# Altium project TempGuard.PrjPcb (part 2 of 2)

## Sheet Display.SchDoc: 7-SEGMENT DISPLAY & DRIVER
size A4; SheetNumber: 2; SheetTotal: 5; DOC_NO_SCH_DWG: #032024040601
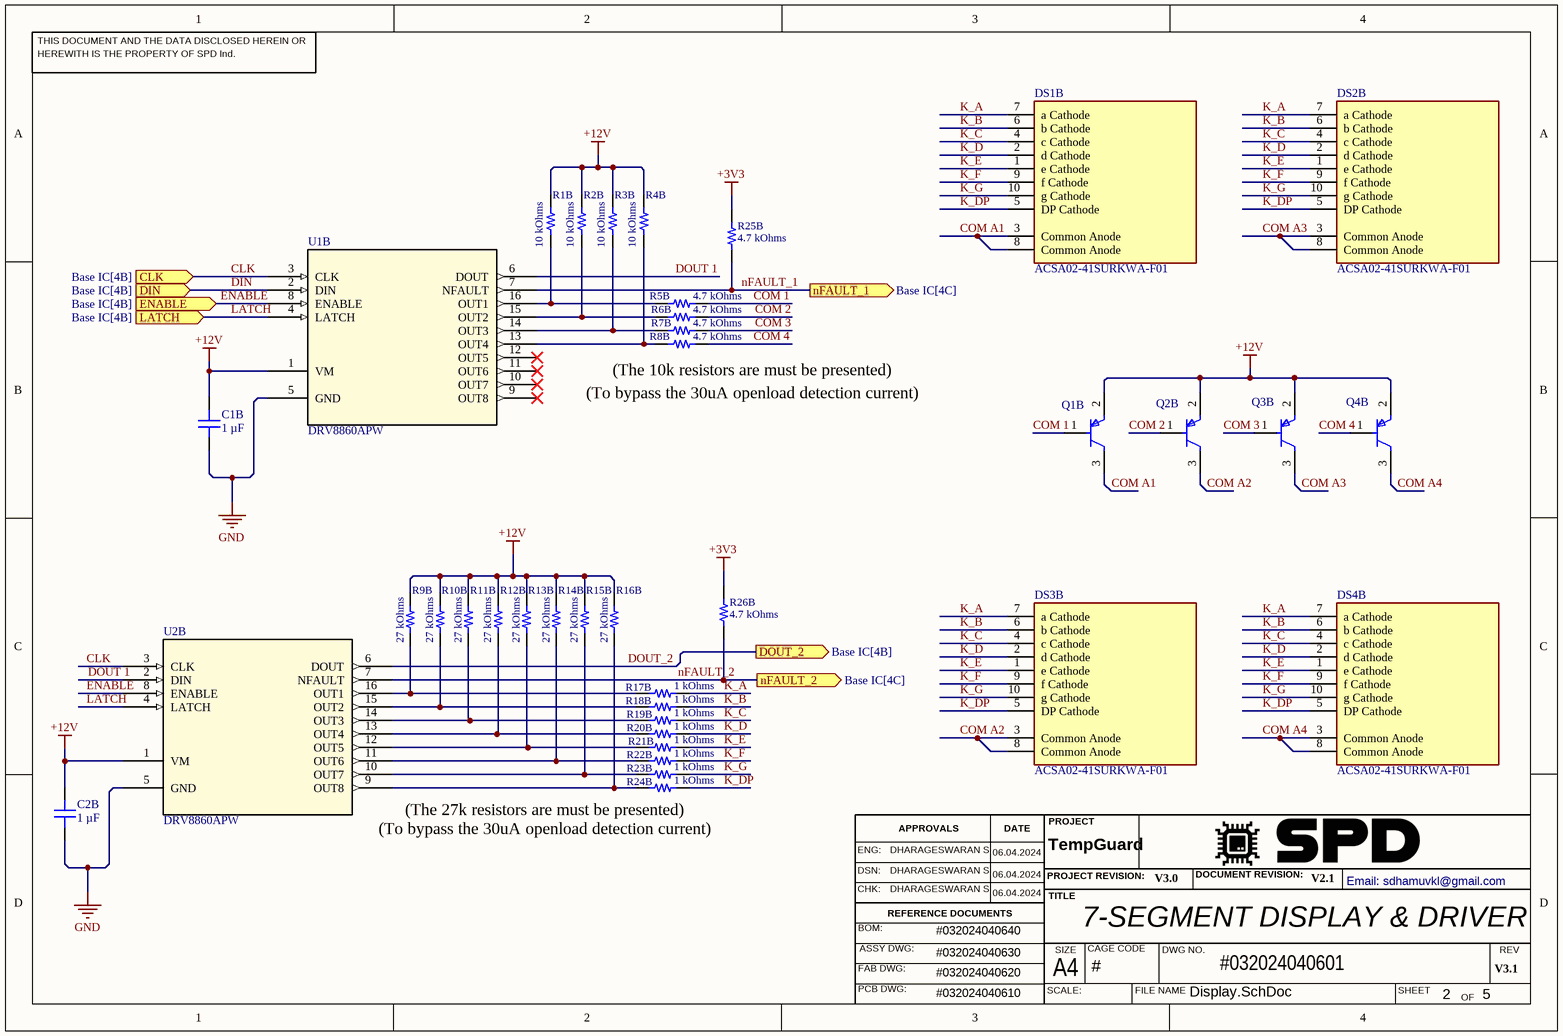
[diagram p3: Display.SchDoc]

### Parts
C1B  1 µF  [CAP 0402_1005]
C2B  1 µF  [CAP 0402_1005]
DS1B  ACSA02-41SURKWA-F01  [FP-ACSA02-41SURKWA-F01-MFG]
DS2B  ACSA02-41SURKWA-F01  [FP-ACSA02-41SURKWA-F01-MFG]
DS3B  ACSA02-41SURKWA-F01  [FP-ACSA02-41SURKWA-F01-MFG]
DS4B  ACSA02-41SURKWA-F01  [FP-ACSA02-41SURKWA-F01-MFG]
Q1B  MMBT3906FZ-7B  [FP-X2-DFN0606-3-MFG]  (value not drawn)
Q2B  MMBT3906FZ-7B  [FP-X2-DFN0606-3-MFG]  (value not drawn)
Q3B  MMBT3906FZ-7B  [FP-X2-DFN0606-3-MFG]  (value not drawn)
Q4B  MMBT3906FZ-7B  [FP-X2-DFN0606-3-MFG]  (value not drawn)
R1B  10 kOhms  [RES 0402_1005]
R2B  10 kOhms  [RES 0402_1005]
R3B  10 kOhms  [RES 0402_1005]
R4B  10 kOhms  [RES 0402_1005]
R5B  4.7 kOhms  [RES 0402_1005]
R6B  4.7 kOhms  [RES 0402_1005]
R7B  4.7 kOhms  [RES 0402_1005]
R8B  4.7 kOhms  [RES 0402_1005]
R9B  27 kOhms  [RES 0402_1005]
R10B  27 kOhms  [RES 0402_1005]
R11B  27 kOhms  [RES 0402_1005]
R12B  27 kOhms  [RES 0402_1005]
R13B  27 kOhms  [RES 0402_1005]
R14B  27 kOhms  [RES 0402_1005]
R15B  27 kOhms  [RES 0402_1005]
R16B  27 kOhms  [RES 0402_1005]
R17B  1 kOhms  [RES 0402_1005]
R18B  1 kOhms  [RES 0402_1005]
R19B  1 kOhms  [RES 0402_1005]
R20B  1 kOhms  [RES 0402_1005]
R21B  1 kOhms  [RES 0402_1005]
R22B  1 kOhms  [RES 0402_1005]
R23B  1 kOhms  [RES 0402_1005]
R24B  1 kOhms  [RES 0402_1005]
R25B  4.7 kOhms  [RES 0402_1005]
R26B  4.7 kOhms  [RES 0402_1005]
U1B  DRV8860APW  [PW_16]
U2B  DRV8860APW  [PW_16]

### Ports
CLK (in, see Base IC[4B]), DIN (in, see Base IC[4B]), DOUT_2 (out, see Base IC[4B]), ENABLE (in, see Base IC[4B]), LATCH (in, see Base IC[4B]), nFAULT_1 (out, see Base IC[4C]), nFAULT_2 (out, see Base IC[4C])

### Nets
+3V3: R25B.2 R26B.2
+12V: C1B.1 C2B.1 Q1B.2(E) Q2B.2(E) Q3B.2(E) Q4B.2(E) R1B.2 R2B.2 R3B.2 R4B.2 R9B.2 R10B.2 R11B.2 R12B.2 R13B.2 R14B.2 R15B.2 R16B.2 U1B.1(VM) U2B.1(VM)
GND: C1B.2 C2B.2 U1B.5(GND) U2B.5(GND)
CLK: U1B.3(CLK) U2B.3(CLK) ; port CLK
COM 1: Q1B.1(B) R5B.2
COM 2: Q2B.1(B) R6B.2
COM 3: Q3B.1(B) R7B.2
COM 4: Q4B.1(B) R8B.2
COM A1: DS1B.3(Common_Anode) DS1B.8(Common_Anode) Q1B.3(C)
COM A2: DS3B.3(Common_Anode) DS3B.8(Common_Anode) Q2B.3(C)
COM A3: DS2B.3(Common_Anode) DS2B.8(Common_Anode) Q3B.3(C)
COM A4: DS4B.3(Common_Anode) DS4B.8(Common_Anode) Q4B.3(C)
DIN: U1B.2(DIN) ; port DIN
DOUT 1: U1B.6(DOUT) U2B.2(DIN)
DOUT_2: U2B.6(DOUT) ; port DOUT_2
ENABLE: U1B.8(ENABLE) U2B.8(ENABLE) ; port ENABLE  [project net DRV_ENABLE]
K_A: DS1B.7(a_Cathode) DS2B.7(a_Cathode) DS3B.7(a_Cathode) DS4B.7(a_Cathode) R17B.2
K_B: DS1B.6(b_Cathode) DS2B.6(b_Cathode) DS3B.6(b_Cathode) DS4B.6(b_Cathode) R18B.2
K_C: DS1B.4(c_Cathode) DS2B.4(c_Cathode) DS3B.4(c_Cathode) DS4B.4(c_Cathode) R19B.2
K_D: DS1B.2(d_Cathode) DS2B.2(d_Cathode) DS3B.2(d_Cathode) DS4B.2(d_Cathode) R20B.2
K_DP: DS1B.5(DP_Cathode) DS2B.5(DP_Cathode) DS3B.5(DP_Cathode) DS4B.5(DP_Cathode) R24B.2
K_E: DS1B.1(e_Cathode) DS2B.1(e_Cathode) DS3B.1(e_Cathode) DS4B.1(e_Cathode) R21B.2
K_F: DS1B.9(f_Cathode) DS2B.9(f_Cathode) DS3B.9(f_Cathode) DS4B.9(f_Cathode) R22B.2
K_G: DS1B.10(g_Cathode) DS2B.10(g_Cathode) DS3B.10(g_Cathode) DS4B.10(g_Cathode) R23B.2
LATCH: U1B.4(LATCH) U2B.4(LATCH) ; port LATCH  [project net DRV_LATCH]
nFAULT_1: R25B.1 U1B.7(NFAULT) ; port nFAULT_1  [project net DRV_nFAULT1]
nFAULT_2: R26B.1 U2B.7(NFAULT) ; port nFAULT_2  [project net DRV_nFAULT2]
NetR1B_1: R1B.1 R5B.1 U1B.16(OUT1)
NetR2B_1: R2B.1 R6B.1 U1B.15(OUT2)
NetR3B_1: R3B.1 R7B.1 U1B.14(OUT3)
NetR4B_1: R4B.1 R8B.1 U1B.13(OUT4)
NetR9B_1: R9B.1 R17B.1 U2B.16(OUT1)
NetR10B_1: R10B.1 R18B.1 U2B.15(OUT2)
NetR11B_1: R11B.1 R19B.1 U2B.14(OUT3)
NetR12B_1: R12B.1 R20B.1 U2B.13(OUT4)
NetR13B_1: R13B.1 R21B.1 U2B.12(OUT5)
NetR14B_1: R14B.1 R22B.1 U2B.11(OUT6)
NetR15B_1: R15B.1 R23B.1 U2B.10(OUT7)
NetR16B_1: R16B.1 R24B.1 U2B.9(OUT8)

Not connected (* = marked no-connect by the designer): U1B 9(OUT8)* 10(OUT7)* 11(OUT6)* 12(OUT5)*

### Notes on the sheet
- (near R8B) (The 10k resistors are must be presented)
- (To bypass the 30uA openload detection current)
- (near R24B) (The 27k resistors are must be presented)
- THIS DOCUMENT AND THE DATA DISCLOSED HEREIN OR
- HEREWITH IS THE PROPERTY OF SPD Ind.
- ENG:
- DHARAGESWARAN S
- APPROVALS
- DATE
- PROJECT
- DSN:
- CHK:
- REFERENCE DOCUMENTS
- PROJECT REVISION:
- TITLE
- DOCUMENT REVISION:
- Email: sdhamuvkl@gmail.com <https://github.com/DhamuVkl>
- BOM:
- FAB DWG:
- PCB DWG:
- ASSY DWG:
- SCALE:
- A4
- SIZE
- CAGE CODE
- FILE NAME
- DWG NO.
- SHEET
- REV
- OF

### Library data of the parts
C1B C2B = GRM155C81C105KE15J: CAP CER MLCC; Manufacturer: Murata Electronics; id: 7124; Temperature Coefficient: X6S; Tolerance: ±10%; Voltage - Rated: 16V; Part Number: GRM155C81C105KE15J; Value: 1 µF; Supplier Part Number 1: 490-GRM155C81C105KE15JCT-ND; ComponentLink2Description: DigiKey Link; PartId: 54559; Supplier 1: DigiKey; Series: GRM; LastUpdated: 2023-06-29T19:02:33.680; Part Status: Active; Capacitance: 1 µF; Device Package: 0402 (1005 Metric); Thickness (Max): 0.022" (0.55mm); Minimum Order: 1; Packaging: CutTape; Applications: General Purpose; Package / Case: 0402 (1005 Metric); Price: 0.01; ComponentLink2URL: https://www.digikey.com/en/products/detail/murata-electronics/GRM155C81C105KE15J/10697200; Lifecycle Status: Active; Operating Temperature: -55°C ~ 105°C; Size / Dimension: 0.039" L x 0.020" W (1.00mm x 0.50mm); Mounting Type: Surface Mount, MLCC
DS1B DS2B DS3B DS4B = CMP-44525-000003-1: DISPLAY 7-SEG 0.2" SGL RED 10SMD; Element Configuration: Common Anode; Forward Current: 30mA; Wavelength: 630nm; Operating Supply Voltage: 1.95V; Number of Characters: 1; Max Power Dissipation: 75mW; Luminous Intensity: 30mcd; Test Current: 20mA; Package Quantity: 650; Width: 0.272inch; Max Operating Temperature: 85°C; Case/Package: SMD/SMT; Illumination Color: Red; Min Operating Temperature: -40°C; Packaging: Tape and Reel; Power Consumption: 75mW; Forward Voltage: 1.95V; Color: Red; Height: 0.315inch
Q1B Q2B Q3B Q4B = CMP-12798-000043-1: TRANS PNP 40V 0.2A X2-DFN060; Continuous Collector Current: -200mA; Gain Bandwidth Product: 250MHz; Collector Base Voltage (VCBO): -40V; Emitter Base Voltage (VEBO): -6V; Element Configuration: Single; hFE Min: 100; Max Power Dissipation: 435mW; Collector Emitter Voltage (VCEO): 400mV; Collector Emitter Saturation Voltage: -400mV; Transition Frequency: 280MHz; Max Collector Current: 200mA; Mount: Surface Mount; Polarity: PNP; Min Operating Temperature: -55°C; Max Operating Temperature: 150°C; Package Quantity: 10000; Max Breakdown Voltage: 40V; Collector Emitter Breakdown Voltage: 40V; Packaging: Tape and Reel; Number of Pins: 3
R1B R2B R3B R4B = AA0402FR-0710KL: RES SMD 10K OHM 1% 1/16W 0402; Manufacturer: Yageo; id: 10610; Temperature Coefficient: ±150ppm/°C; Power (Watts): 0.063W, 1/16W; Part Number: AA0402FR-0710KL; Height - Seated (Max): 0.015" (0.37mm); Supplier Part Number 1: 13-AA0402FR-0710KLCT-ND; Supplier Device Package: 0402; ComponentLink1Description: Datasheet; ComponentLink2URL: https://www.digikey.com/en/products/detail/yageo/AA0402FR-0710KL/5887729; Features: Anti-Sulfur, Automotive AEC-Q200, Moisture Resistant; ComponentLink1URL: https://www.yageo.com/upload/media/product/productsearch/datasheet/rchip/PYu-AA_51_RoHS_L_3.pdf; Composition: Thick Film; Tolerance: ±1%; Supplier 1: DigiKey; Series: AA; Part Status: Active; ComponentLink2Description: DigiKey Link; Device Package: 0402 (1005 Metric); Packaging: TapeAndReel; Ratings: AEC-Q200; Minimum Order: 1; Package / Case: 0402 (1005 Metric); PartId: 59190; Lifecycle Status: Active; LastUpdated: 2023-01-02T20:20:10.303; Operating Temperature: -55°C ~ 155°C; Number Of Terminations: 2; Value: 10 kOhms; Size / Dimension: 0.039" L x 0.020" W (1.00mm x 0.50mm); Price: 0.01; Resistance: 10 kOhms
R5B R6B R7B R8B R25B R26B = AC0402FR-074K7L: RES SMD 4.7K OHM 1% 1/16W 0402; Manufacturer: Yageo; id: 4996; Temperature Coefficient: ±100ppm/°C; Power (Watts): 0.063W, 1/16W; Part Number: AC0402FR-074K7L; Height - Seated (Max): 0.015" (0.37mm); Supplier Part Number 1: YAG3497CT-ND; Supplier Device Package: 0402; ComponentLink1Description: Datasheet; ComponentLink2URL: https://www.digikey.com/en/products/detail/yageo/AC0402FR-074K7L/5895396; Features: Automotive AEC-Q200, Moisture Resistant; ComponentLink1URL: https://www.yageo.com/upload/media/product/productsearch/datasheet/rchip/PYu-AC_51_RoHS_L_7.pdf; Composition: Thick Film; Tolerance: ±1%; Supplier 1: DigiKey; Series: AC; Part Status: Active; ComponentLink2Description: DigiKey Link; Device Package: 0402 (1005 Metric); Packaging: CutTape; Ratings: AEC-Q200; Minimum Order: 1; Package / Case: 0402 (1005 Metric); PartId: 12051; Lifecycle Status: Active; LastUpdated: 2023-01-02T20:21:09.847; Operating Temperature: -55°C ~ 155°C; Number Of Terminations: 2; Value: 4.7 kOhms; Size / Dimension: 0.039" L x 0.020" W (1.00mm x 0.50mm); Price: 0.01; Resistance: 4.7 kOhms
R9B R10B R11B R12B R13B R14B R15B R16B = AC0402FR-0727KL: RES SMD 27K OHM 1% 1/16W 0402; Manufacturer: Yageo; id: 5006; Temperature Coefficient: ±100ppm/°C; Power (Watts): 0.063W, 1/16W; Part Number: AC0402FR-0727KL; Height - Seated (Max): 0.015" (0.37mm); Supplier Part Number 1: YAG3466CT-ND; Supplier Device Package: 0402; ComponentLink1Description: Datasheet; ComponentLink2URL: https://www.digikey.com/en/products/detail/yageo/AC0402FR-0727KL/5895228; Features: Automotive AEC-Q200, Moisture Resistant; ComponentLink1URL: https://www.yageo.com/upload/media/product/productsearch/datasheet/rchip/PYu-AC_51_RoHS_L_7.pdf; Composition: Thick Film; Tolerance: ±1%; Supplier 1: DigiKey; Series: AC; Part Status: Active; ComponentLink2Description: DigiKey Link; Device Package: 0402 (1005 Metric); Packaging: CutTape; Ratings: AEC-Q200; Minimum Order: 1; Package / Case: 0402 (1005 Metric); PartId: 12068; Lifecycle Status: Active; LastUpdated: 2023-01-02T20:21:09.767; Operating Temperature: -55°C ~ 155°C; Number Of Terminations: 2; Value: 27 kOhms; Size / Dimension: 0.039" L x 0.020" W (1.00mm x 0.50mm); Price: 0.01; Resistance: 27 kOhms
R17B R18B R19B R20B R21B R22B R23B R24B = AA0402FR-071KL: RES SMD 1K OHM 1% 1/16W 0402; Manufacturer: Yageo; id: 10598; Temperature Coefficient: ±150ppm/°C; Power (Watts): 0.063W, 1/16W; Part Number: AA0402FR-071KL; Height - Seated (Max): 0.015" (0.37mm); Supplier Part Number 1: 13-AA0402FR-071KLCT-ND; Supplier Device Package: 0402; ComponentLink1Description: Datasheet; ComponentLink2URL: https://www.digikey.com/en/products/detail/yageo/AA0402FR-071KL/5887878; Features: Anti-Sulfur, Automotive AEC-Q200, Moisture Resistant; ComponentLink1URL: https://www.yageo.com/upload/media/product/productsearch/datasheet/rchip/PYu-AA_51_RoHS_L_3.pdf; Composition: Thick Film; Tolerance: ±1%; Supplier 1: DigiKey; Series: AA; Part Status: Active; ComponentLink2Description: DigiKey Link; Device Package: 0402 (1005 Metric); Packaging: TapeAndReel; Ratings: AEC-Q200; Minimum Order: 1; Package / Case: 0402 (1005 Metric); PartId: 59178; Lifecycle Status: Active; LastUpdated: 2023-01-02T20:20:10.210; Operating Temperature: -55°C ~ 155°C; Number Of Terminations: 2; Value: 1 kOhms; Size / Dimension: 0.039" L x 0.020" W (1.00mm x 0.50mm); Price: 0.01; Resistance: 1 kOhms
U1B U2B = DRV8860APW: No Description Available; Mfr_Name: Texas Instruments; RefDes: RefDes; Type: Type; Supplier 1: Mouser; Supplier Part Number 1: 595-DRV8860APWR

## Sheet MainPower & Regulation.SchDoc: LOAD CONTROL
size A4; SheetNumber: 5; SheetTotal: 5; DOC_NO_SCH_DWG: #032024040604
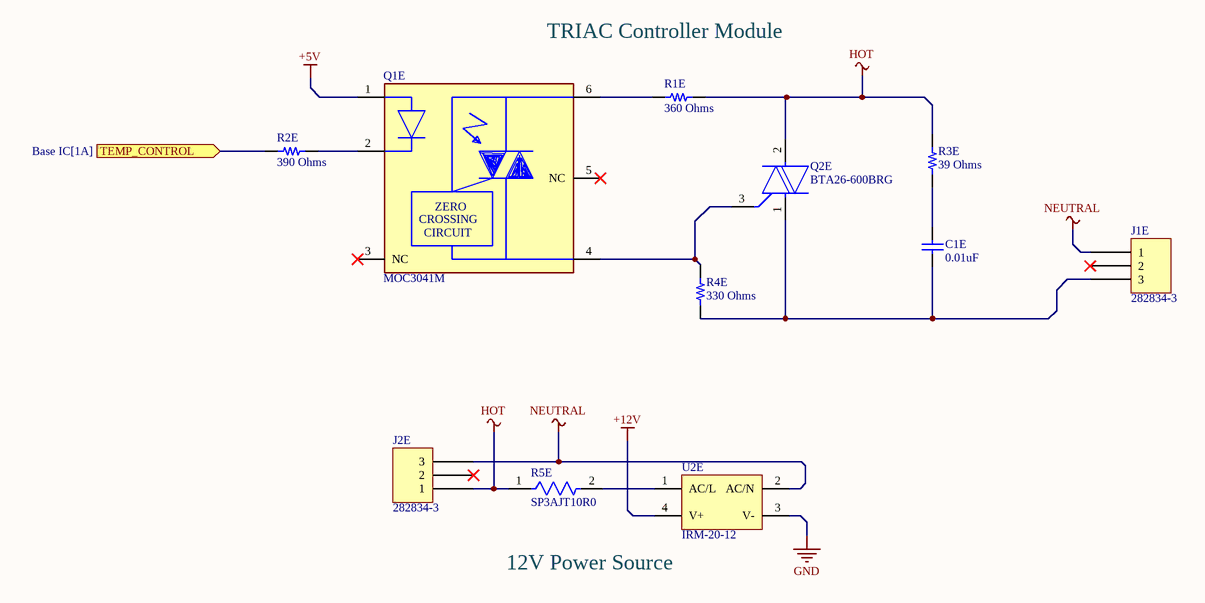
[diagram p4: MainPower & Regulation.SchDoc]

### Parts
C1E  0.01uF  [WCAP-FTXX_L13W5H11_CS]
J1E  282834-3  [TE 282834-3]
J2E  282834-3  [TE 282834-3]
Q1E  MOC3041M  [FP-646BX-MFG]
Q2E  BTA26-600BRG  [BTA26-600BRG]
R1E  360 Ohms  [RES 2512_6432]
R2E  390 Ohms  [RES 0402_1005]
R3E  39 Ohms  [RES 2512_6432]
R4E  330 Ohms  [RES 2512_6432]
R5E  SP3AJT10R0  [FP-SP3A-MFG]
U2E  IRM-20-12  [MEANW-IRM-20-12]

### Ports
TEMP_CONTROL (in, see Base IC[1A])

### Nets
+5V: Q1E.1(A)
+12V: U2E.4(V+)
GND: U2E.3(V-)
HOT: J2E.1 Q2E.2(A2) R1E.2 R3E.2 R5E.1
NEUTRAL: J1E.1 J2E.3 U2E.2(AC/N)
TEMP_OUT: R2E.1 ; port TEMP_CONTROL
NetC1E_1: C1E.1 J1E.3 Q2E.1(A1) R4E.1
NetC1E_2: C1E.2 R3E.1
NetQ1E_2: Q1E.2(C) R2E.2
NetQ1E_4: Q1E.4(1_MAIN_TERM.) Q2E.3(G) R4E.2
NetQ1E_6: Q1E.6(2_MAIN_TERM.) R1E.1
NetR5E_2: R5E.2 U2E.1(AC/L)

Not connected (* = marked no-connect by the designer): J1E 2*; J2E 2*; Q1E 3(NC)* 5(NC)*

### Notes on the sheet
- TRIAC Controller Module
- (near U2E) 12V Power Source
- THIS DOCUMENT AND THE DATA DISCLOSED HEREIN OR
- HEREWITH IS THE PROPERTY OF SPD Ind.
- ENG:
- DHARAGESWARAN S
- APPROVALS
- DATE
- PROJECT
- DSN:
- CHK:
- REFERENCE DOCUMENTS
- PROJECT REVISION:
- TITLE
- DOCUMENT REVISION:
- Email: sdhamuvkl@gmail.com <https://github.com/DhamuVkl>
- BOM:
- FAB DWG:
- PCB DWG:
- ASSY DWG:
- SCALE:
- A4
- SIZE
- CAGE CODE
- FILE NAME
- DWG NO.
- SHEET
- REV
- OF
- (in symbol CMP-07144-000005-1) ZERO; CROSSING; CIRCUIT

### Library data of the parts
C1E = CMP-03913-51400137-2: 890334023006CS WCAP-FTXX Film Capacitor 10nF 310Vac; Dielectric: PP; Pin Length: 4mm; Tolerance: 10%; Pitch: 10mm; Voltage Rating (AC): 310V; Insulation Resistance: 30GΩ; Hole Diameter: 900µm; Max Operating Temperature: 105°C; Min Operating Temperature: -40°C; Capacitance: 10nF; Termination: PC Pins; Packaging: Carton; Height - Seated (Max): 11.5062mm; RoHS: Compliant; Length: 13mm; Lead Pitch: 10.0076mm; NexarPartId: 51400137; Case/Package: Radial; Width: 5mm; Mount: Through Hole; Dielectric Material: PP; Voltage Rating: 310V; Voltage Rating (DC): 310V; Height: 11mm; REACH SVHC: Unknown
J1E J2E = 282834-3: TERM BLK 3P SIDE ENT 2.54MM PCB; Manufacturer: TE Connectivity AMP Connectors; id: 2; Wire Gauge: 16-30 AWG; Voltage: 150V; Positions Per Level: 3; Number Of Levels: 1; Pitch: 0.100" (2.54mm); Mating Orientation: Horizontal with Board; Wire Termination: Screw - Rising Cage Clamp; Current: 10A; Part Number: 282834-3; Supplier Part Number 1: A98334-ND; ComponentLink1Description: Datasheet; Color: Green; ComponentLink2URL: http://digikey.com/product-detail/en/te-connectivity-amp-connectors/282834-3/A98334-ND/1153264; ComponentLink1URL: https://www.te.com/commerce/DocumentDelivery/DDEController?Action=srchrtrv&DocNm=282834&DocType=Customer+Drawing&DocLang=English; Supplier 1: DigiKey; Series: Buchanan; Part Status: Active; ComponentLink2Description: DigiKey Link; Packaging: Bulk; Minimum Order: 1; Lifecycle Status: Active; LastUpdated: 2020-01-15T04:15:50.317; Mounting Type: Through Hole; Price: 2.01
Q1E = CMP-07144-000005-1: OPTOISOLATOR 4.17KV TRIAC 6DIP; Manufacturer: ON Semiconductor; Forward Voltage: 1.25V; Power Dissipation: 250mW; Forward Current: 30mA; Reverse Voltage: 6V; Max Junction Temp: +100°C; Isolation Voltage: 4170Vrms; Standoff Height: 0.38mm; Octopart: https://octopart.com/moc3041m-on+semiconductor-84330395; Temperature Range Low: -40°C; Category: Trans; Package: 646BX; Height: 5.08mm; Manufacturer Part Number: MOC3041M; ComponentLink2Description: Datasheet; Device Class L2: Optocouplers; Device Class L1: Optoelectronics; Device Class L3: unset; Automotive: No; RoHS: TRUE; Mouser Description: Optocoupler Triac AC Output 1 Channel 400VDRM 6-Pin Plastic Dip White Bulk; Temperature: -40°C to +85°C; Lead Free: Yes; ComponentLink2URL: https://www.onsemi.com/pub/Collateral/MOC3043M-D.pdf; Digikey Description: OPTOISOLATOR 4.17KV TRIAC 6DIP; Temperature Range High: +85°C; Footprint Url: https://www.onsemi.com/pub/Collateral/646BX.PDF
R1E = RK73B3ATTE361J: RES 360 OHM 5% 1W 2512; Manufacturer: KOA Speer Electronics, Inc.; id: 708; Temperature Coefficient: ±200ppm/°C; Part Number: RK73B3ATTE361J; Height - Seated (Max): 0.028" (0.70mm); Supplier Part Number 1: 2019-RK73B3ATTE361JCT-ND; Supplier Device Package: 2512; ComponentLink1Description: Datasheet; ComponentLink2URL: http://digikey.com/product-detail/en/koa-speer-electronics-inc/RK73B3ATTE361J/2019-RK73B3ATTE361JCT-ND/10425443; Features: Automotive AEC-Q200, Moisture Resistant; ComponentLink1URL: http://www.koaspeer.com/catimages/Products/RK73B/RK73B.pdf; Composition: Thick Film; Tolerance: ±5%; Supplier 1: DigiKey; Series: RK73B; Part Status: Active; ComponentLink2Description: DigiKey Link; Device Package: 2512 (6432 Metric); Packaging: TapeAndReel; Ratings: AEC-Q200; Minimum Order: 1; Package / Case: 2512 (6432 Metric); Lifecycle Status: Active; LastUpdated: 2020-09-02T01:26:53.140; Operating Temperature: -55°C ~ 155°C; Number Of Terminations: 2; Value: 360 Ohms; Size / Dimension: 0.248" L x 0.122" W (6.30mm x 3.10mm); Power (Watts): 1W; Price: 0.04; Resistance: 360 Ohms
R2E = CR0402-FX-3900GLF: RES SMD 390 OHM 1% 1/16W 0402; Manufacturer: Bourns Inc.; id: 5421; Temperature Coefficient: ±100ppm/°C; Power (Watts): 0.063W, 1/16W; Part Number: CR0402-FX-3900GLF; Height - Seated (Max): 0.016" (0.40mm); Supplier Part Number 1: CR0402-FX-3900GLFCT-ND; Supplier Device Package: 0402; ComponentLink1Description: Datasheet; ComponentLink2URL: https://www.digikey.com/en/products/detail/bourns-inc/CR0402-FX-3900GLF/3783350; ComponentLink1URL: https://www.bourns.com/docs/Product-Datasheets/CR0402.pdf; Composition: Thick Film; Tolerance: ±1%; Supplier 1: DigiKey; Series: CR0402; Part Status: Active; ComponentLink2Description: DigiKey Link; Device Package: 0402 (1005 Metric); Packaging: CutTape; Minimum Order: 1; Package / Case: 0402 (1005 Metric); PartId: 12887; Lifecycle Status: Active; LastUpdated: 2023-01-02T20:21:06.287; Operating Temperature: -55°C ~ 155°C; Number Of Terminations: 2; Value: 390 Ohms; Size / Dimension: 0.039" L x 0.020" W (1.00mm x 0.50mm); Price: 0.01; Resistance: 390 Ohms
R3E = RK73B3ATTE390J: RES 39 OHM 5% 1W 2512; Manufacturer: KOA Speer Electronics, Inc.; id: 296; Temperature Coefficient: ±200ppm/°C; Part Number: RK73B3ATTE390J; Height - Seated (Max): 0.028" (0.70mm); Supplier Part Number 1: 2019-RK73B3ATTE390JCT-ND; Supplier Device Package: 2512; ComponentLink1Description: Datasheet; ComponentLink2URL: http://digikey.com/product-detail/en/koa-speer-electronics-inc/RK73B3ATTE390J/2019-RK73B3ATTE390JCT-ND/10425325; Features: Automotive AEC-Q200, Moisture Resistant; ComponentLink1URL: http://www.koaspeer.com/catimages/Products/RK73B/RK73B.pdf; Composition: Thick Film; Tolerance: ±5%; Supplier 1: DigiKey; Series: RK73B; Part Status: Active; ComponentLink2Description: DigiKey Link; Device Package: 2512 (6432 Metric); Packaging: TapeAndReel; Ratings: AEC-Q200; Minimum Order: 1; Package / Case: 2512 (6432 Metric); Lifecycle Status: Active; LastUpdated: 2023-01-02T21:07:20.787; Operating Temperature: -55°C ~ 155°C; Number Of Terminations: 2; Value: 39 Ohms; Size / Dimension: 0.248" L x 0.122" W (6.30mm x 3.10mm); Power (Watts): 1W; Price: 0.04; Resistance: 39 Ohms
R4E = RK73H3ATTE3300F: RES 330 OHM 1% 1W 2512; Manufacturer: KOA Speer Electronics, Inc.; id: 684; Temperature Coefficient: ±100ppm/°C; Part Number: RK73H3ATTE3300F; Height - Seated (Max): 0.028" (0.70mm); Supplier Part Number 1: 2019-RK73H3ATTE3300FCT-ND; Supplier Device Package: 2512; ComponentLink1Description: Datasheet; ComponentLink2URL: http://digikey.com/product-detail/en/koa-speer-electronics-inc/RK73H3ATTE3300F/2019-RK73H3ATTE3300FCT-ND/10425036; Features: Automotive AEC-Q200, Moisture Resistant; ComponentLink1URL: http://www.koaspeer.com/catimages/Products/RK73H/RK73H.pdf; Composition: Thick Film; Tolerance: ±1%; Supplier 1: DigiKey; Series: RK73H; Part Status: Active; ComponentLink2Description: DigiKey Link; Device Package: 2512 (6432 Metric); Packaging: TapeAndReel; Ratings: AEC-Q200; Minimum Order: 1; Package / Case: 2512 (6432 Metric); Lifecycle Status: Active; LastUpdated: 2020-09-02T01:26:53.040; Operating Temperature: -55°C ~ 155°C; Number Of Terminations: 2; Value: 330 Ohms; Size / Dimension: 0.248" L x 0.122" W (6.30mm x 3.10mm); Power (Watts): 1W; Price: 0.05; Resistance: 330 Ohms
R5E = CMP-26528-000004-1: RES 10 OHM 5% 4W AXIAL; Resistance: 10R; Temperature Coefficient: 20ppm/°C; Power Rating: 4W; Series: SP; Mount: Through Hole; Diameter: 5.5mm; RoHS Compliant: Yes; Length: 12.7mm; Max Operating Temperature: 350°C; Max Power Dissipation: 4W; Number of Terminations: 2; Resistor Type: Wirewound; Min Operating Temperature: -55°C; Case/Package: Axial; Tolerance: 5%; Package Quantity: 1; Packaging: Cut Tape
U2E = CMP-2000-07460-1: Single Output Encapsulated Type, 12 V, 1.8 A, 21.6 W, -40 to 85 degC, 4-Pin THD, RoHS; Manufacturer: Mean Well; Output Current: 1.8A; Output Power: 21.6W; Voltage - Output 1: 12V; Efficiency: 84%; Approvals: CB; Number of Outputs: 1; Length: 53mm; RoHSCompliant: true; Lead Free: LeadFree; Packaging: Bulk; Package Description: 4-Pin Through Hole Device, Body 52.4 x 27.2 mm, Height 24 mm; Number of Pins: 4; Mount: ThroughHole; Min Operating Temperature: -30degC; Manufacturer URL: http://www.meanwellusa.com/; Weight: 2.081164oz; Package Quantity: 240; Package Reference: IRM-20-12-4; Datasheet URL: http://datasheet.octopart.com/IRM-20-12-Mean-Well-datasheet-42021592.pdf; Max Output Power: 21.6W; Max Operating Temperature: 70degC; Height: 24mm; Mounting Technology: ThroughHole; Datasheet Version: 06/2015; Current - Output 1: 1.8A; Width: 28mm
Q2E = BTA26-600BRG: Supplier 1: Future Electronics; Supplier Part Number 1: 1404508

## Nets that join several sheets
+3V3: Base IC (J2A.5 R10A.2 R16A.1), Power (5 pins), UART (6 pins), Display (R25B.2 R26B.2)
+5V: Base IC (7 pins), Power (5 pins), UART (C1C.2 U1C.4 U1C.20), MainPower & Regulation (Q1E.1)
+12V: Power (C7D.1 IC1D.5 R3D.2 U2D.4), Display (20 pins), MainPower & Regulation (U2E.4)
GND: Base IC (17 pins), Power (18 pins), UART (8 pins), Display (C1B.2 C2B.2 U1B.5 U2B.5), MainPower & Regulation (U2E.3)
CLK: Base IC (U1A.28), Display (U1B.3 U2B.3)
DIN: Base IC (U1A.27), Display (U1B.2)
DOUT_2: Base IC (U1A.15), Display (U2B.6)
DRV_ENABLE: Base IC (U1A.30), Display (U1B.8 U2B.8)
DRV_LATCH: Base IC (U1A.29), Display (U1B.4 U2B.4)
DRV_nFAULT1: Base IC (U1A.17), Display (R25B.1 U1B.7)
DRV_nFAULT2: Base IC (U1A.16), Display (R26B.1 U2B.7)
MCU_RESET: Base IC (C5A.2 R16A.2 S2A.1 U1A.6), UART (J1C.3)
MCU_RXD: Base IC (U1A.10), UART (TP7C.1 U1C.1)
MCU_TXD: Base IC (U1A.9), UART (TP8C.1 U1C.5)
SWCLK: Base IC (R12A.1 U1A.25), UART (J1C.4)
SWDIO: Base IC (U1A.24), UART (J1C.2)
TEMP_OUT: Base IC (R9A.1 U1A.14), MainPower & Regulation (R2E.1)
TVS_D_N: Power (D1D.3), UART (U1C.16)
TVS_D_P: Power (D1D.1), UART (U1C.15)